# EasyEDA Pro project PicoPocket_Royal.epro

# Board PicoPocket_Royal
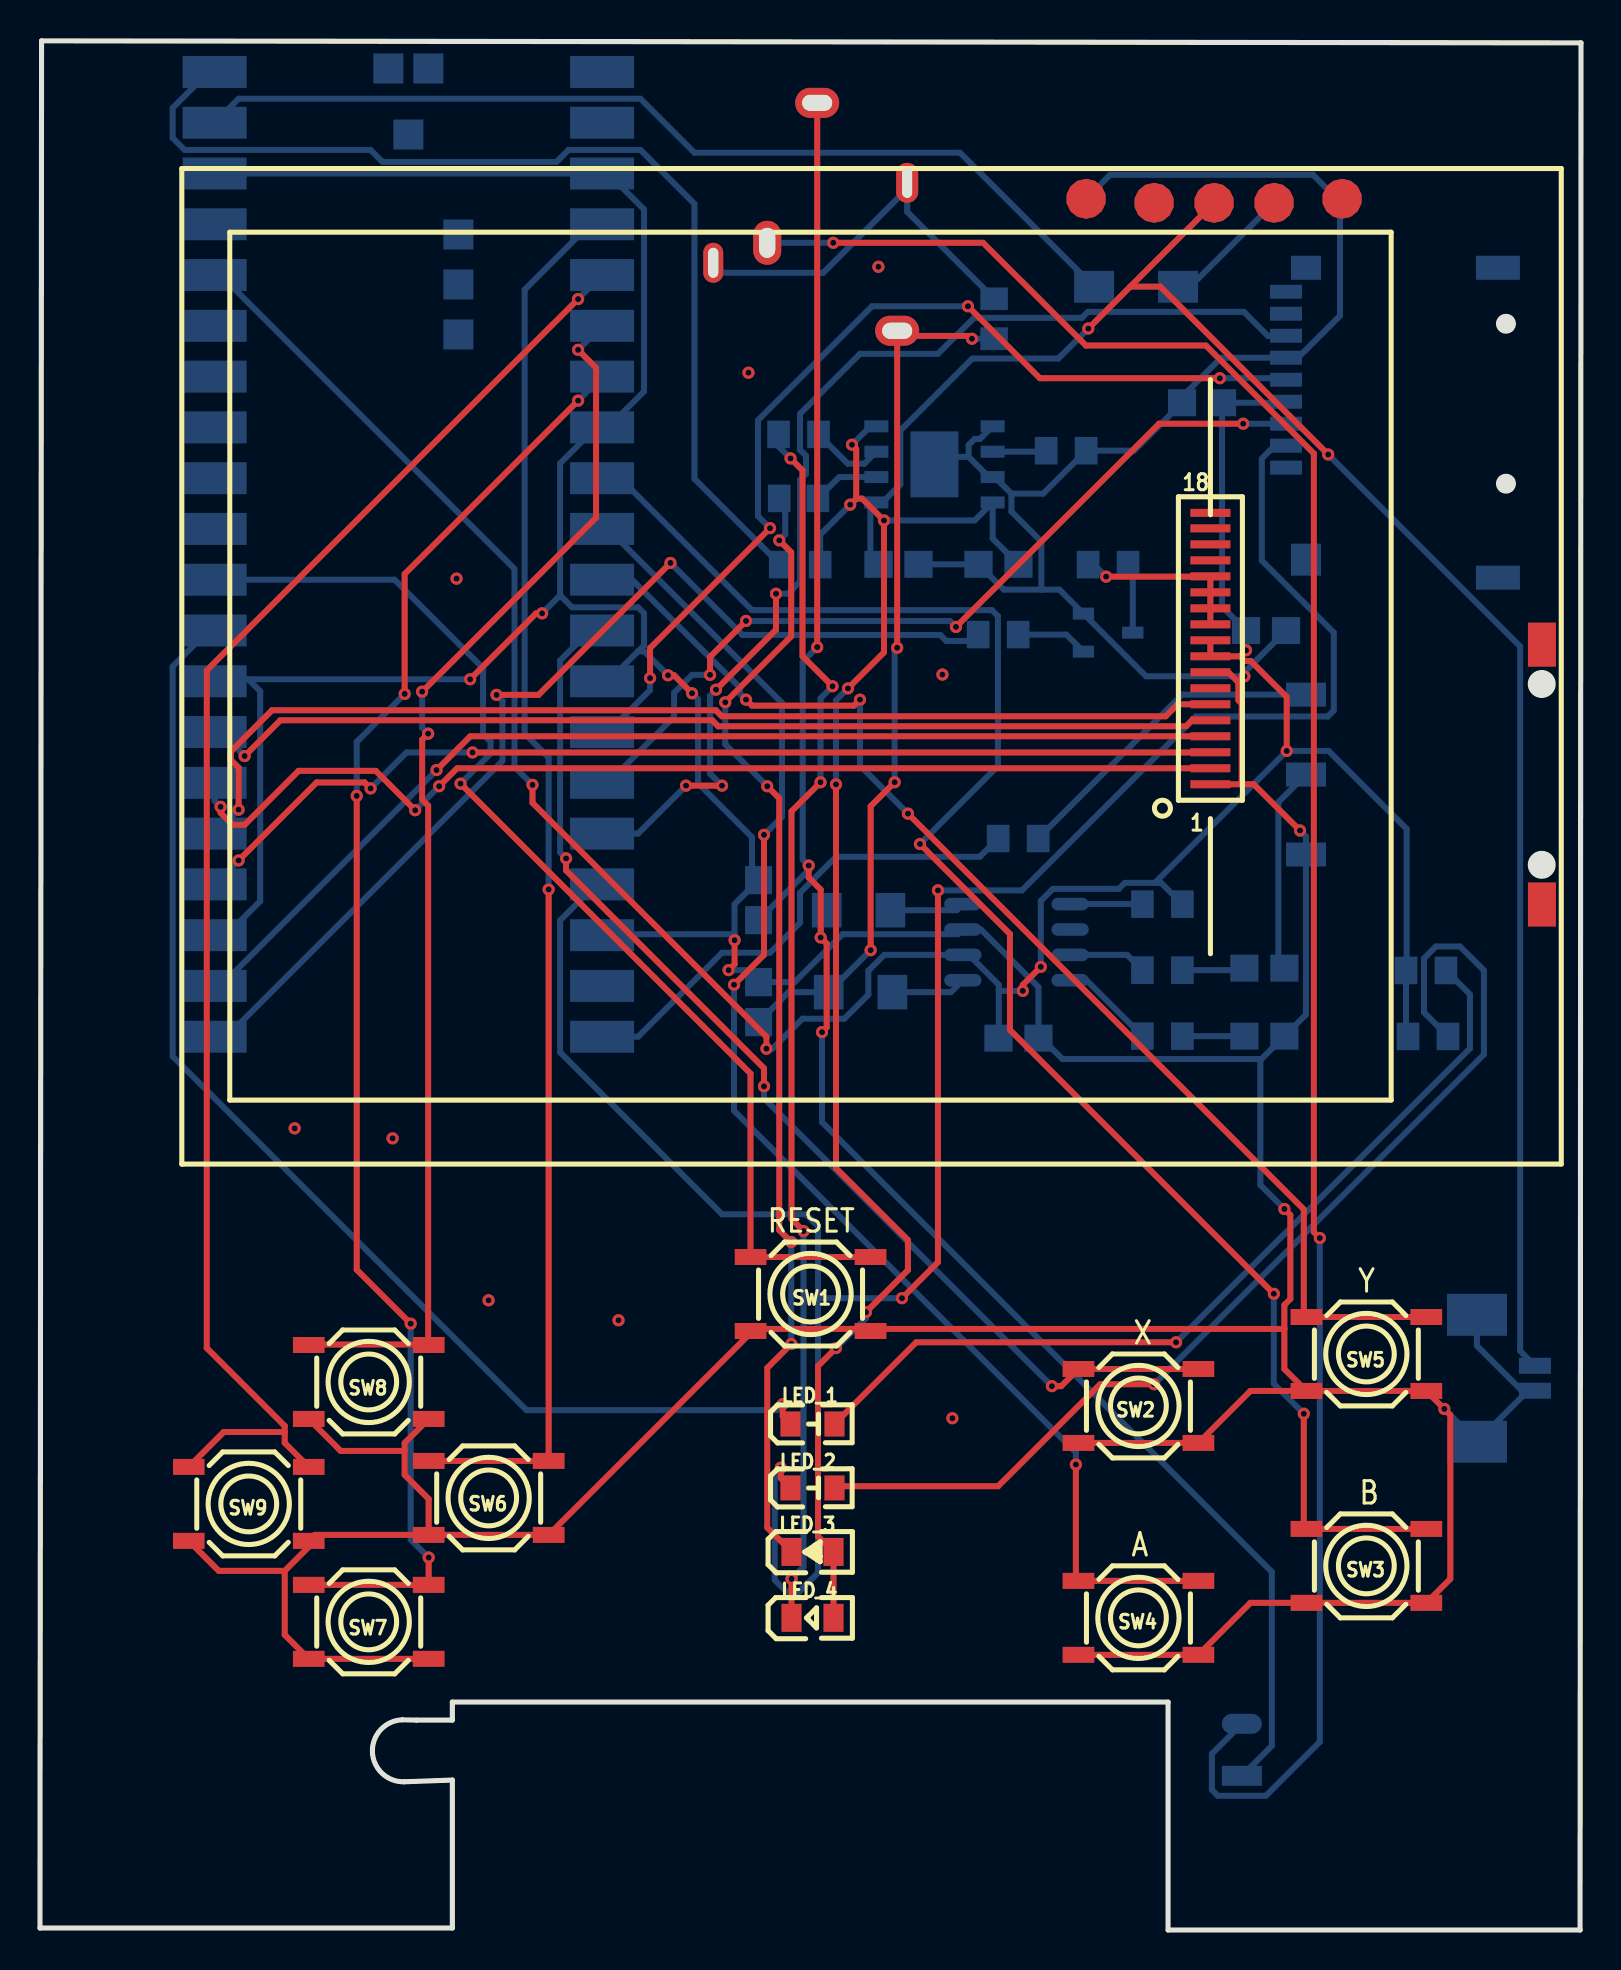
[diagram p0: board, top side]
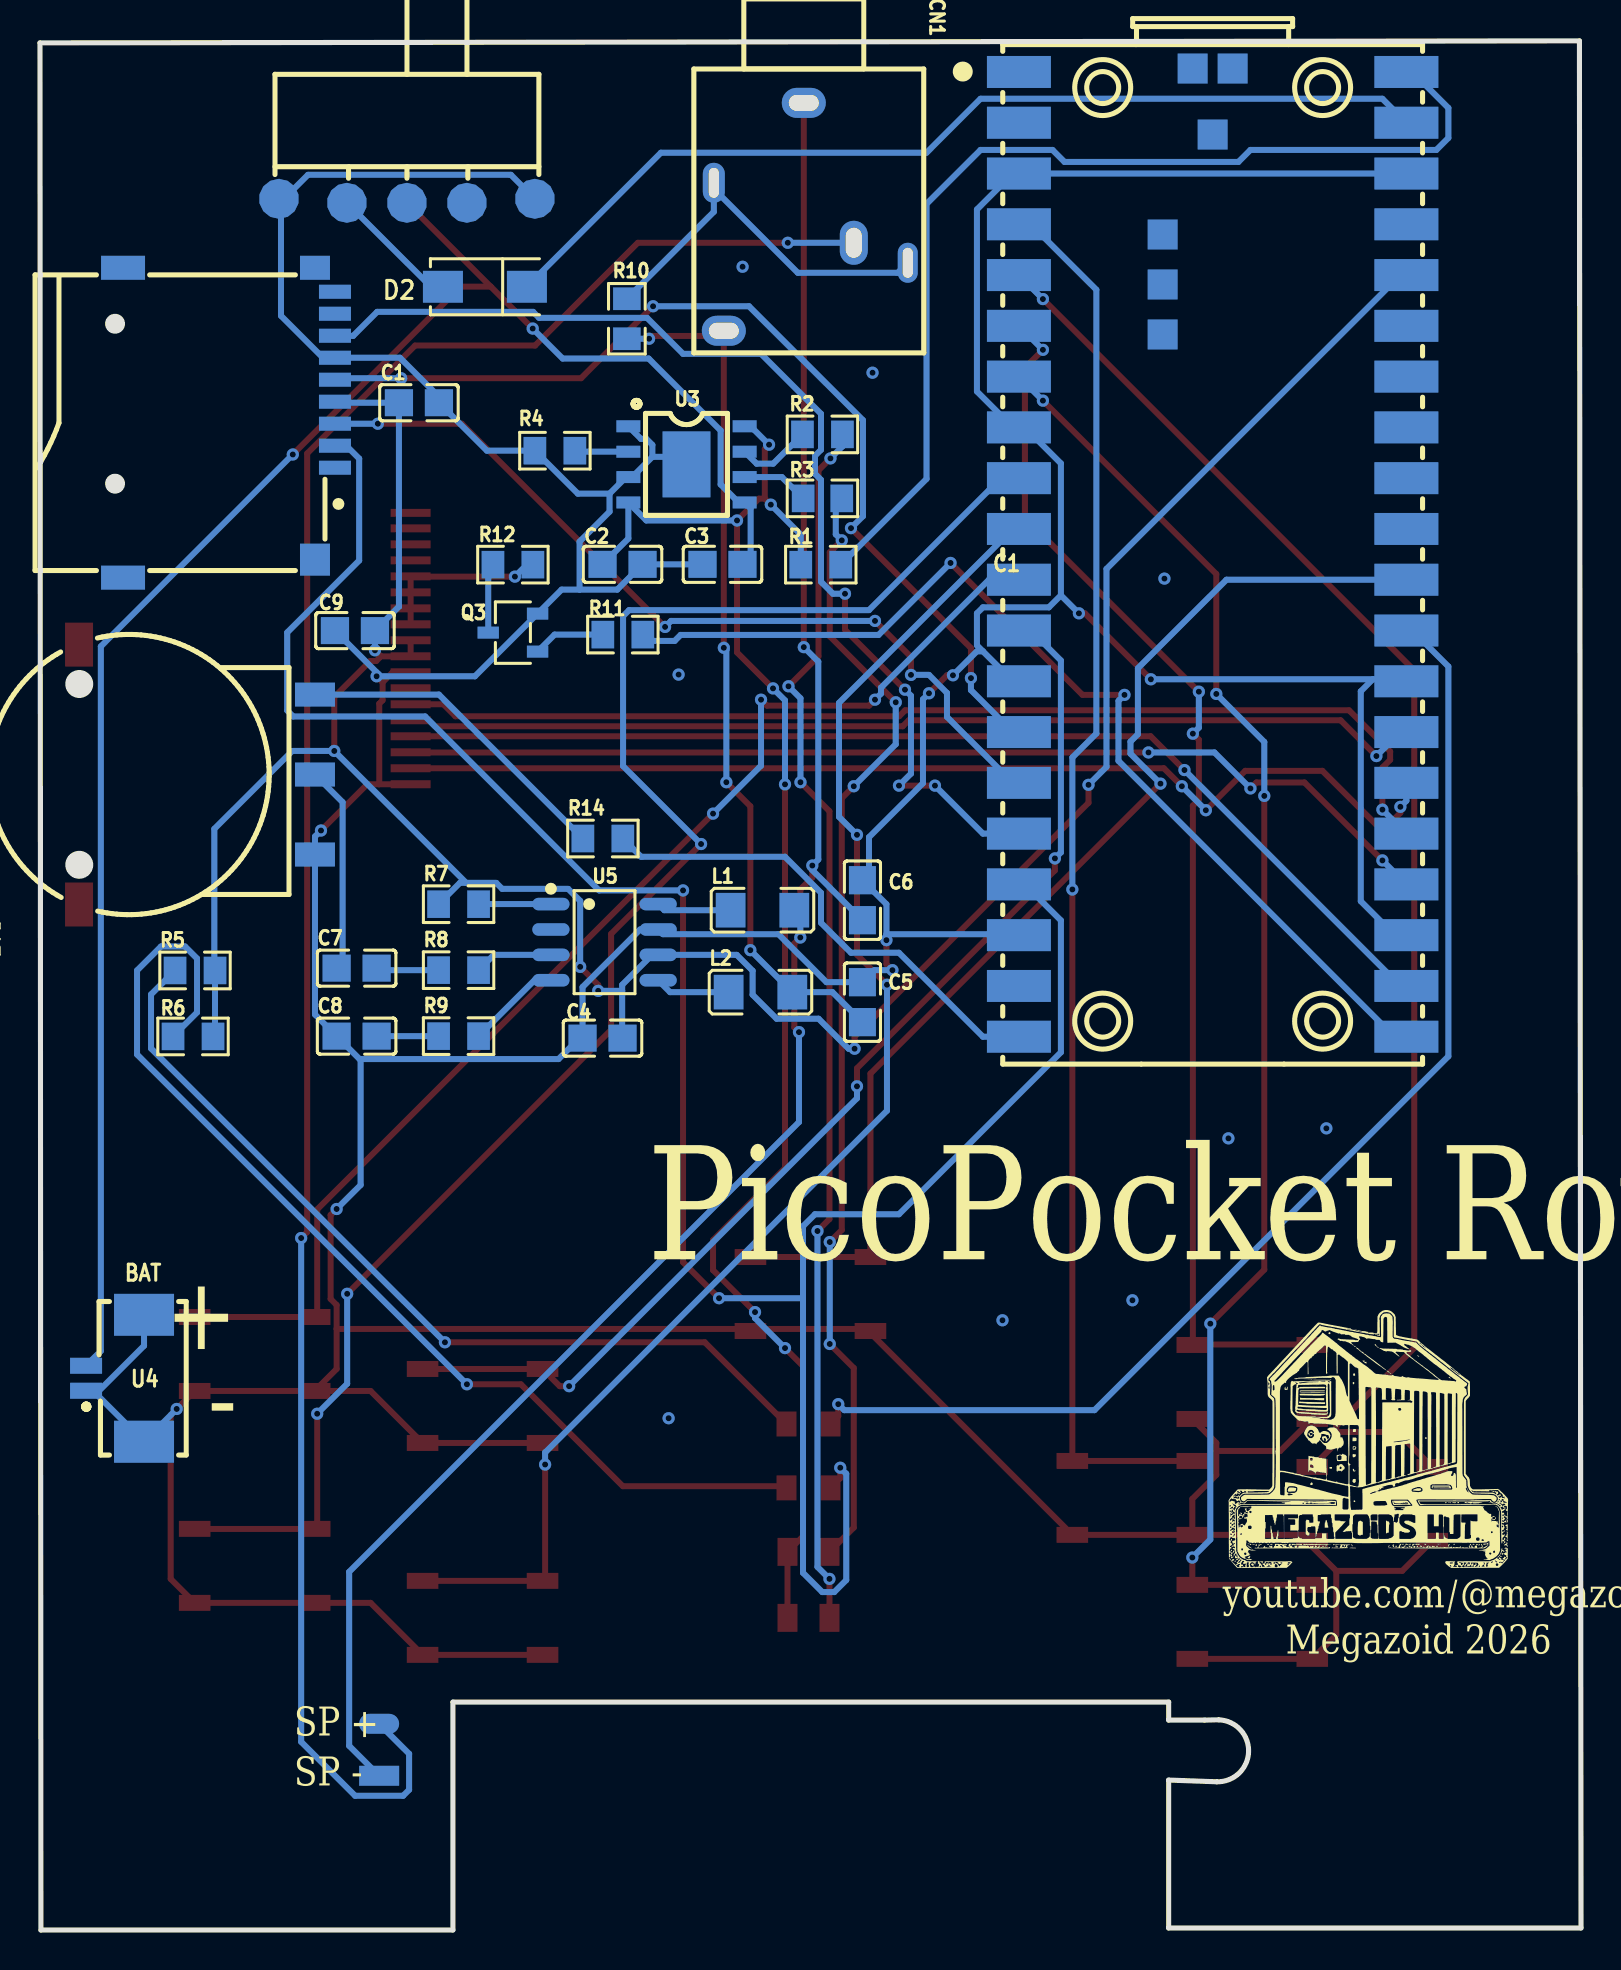
[diagram p1: board, bottom side, seen from below]

Outline 77.08 x 94.5 mm; copper layers: Top Layer, Bottom Layer. Coordinates in mm from the lower left corner of the outline.
Outline path: 0,0.1 0.08,94.5 77.08,94.4 77.03,0 56.43,0 56.43,11.4 20.62,11.4 20.62,10.5 18.83,10.5 18.12,10.52 arc(16.62,8.92) 18.22,7.41 20.62,7.5 20.62,0.1 0,0.1
Stack: Top Layer 0.035mm / Dielectric1 1.51mm FR4 er 4.5 / Bottom Layer 0.035mm

## Design rules (mm)
template: Custom Config
spacing copperThickness1oz (default): track to track 0.102, other pairs 0.152 to 0.3
spacing copperThickness2oz: track to track 0.203, other pairs 0.152 to 0.3
track width copperThickness1oz (default): min 0.127, default 0.3, max 2.54
track width copperThickness2oz: min 0.203, default 0.254, max 2.54
differential pair differentialPair (default): width min 0.127, default 0.254, max 2.54; gap min 0.152, default 0.152
via viaSize (default): diameter min 0.5, default 0.61, max 10; hole min 0.3, default 0.305, max 6.3

## Placement (name value [footprint] x y rotation side)
C1  100nF  [C0805]  58.12 76.4 0 bottom
C2  100nF  [C0805]  47.94 68.31 0 bottom
C3  100nF  [C0805]  42.94 68.31 180 bottom
C4  10uF  [C0805]  48.94 44.62 0 bottom
C5  220pF  [C0805]  35.94 46.42 270 bottom
C6  220pF  [C0805]  35.94 51.52 270 bottom
C7  1uF  [C0805]  61.24 48.12 180 bottom
C8  1uF  [C0805]  61.24 44.72 180 bottom
C9  100nF  [C0805]  61.33 65 180 bottom
CN1  PJ-324M  [AUDIO-TH_PJ-324M]  38.53 85.7 270 bottom
D2  SS12_C727049  [SMA_L4.3-W2.5-LS5.0-RD]  54.83 82.2 0 bottom
L1  -  [L1206]  40.94 51.02 180 bottom
L2  -  [L1206]  41.04 46.92 180 bottom
LCD2  LCD DISPLAY gmt028-01-p  [LCD DISPLAY ER-TFT020-2]  58.54 61.72 180 top
LED_1  LTST-C170KSKT  [LED0805-RD_YELLOW]  38.64 25.31 0 top
LED_2  LTST-C170KFKT  [LED0805-RD_ORANGE]  38.64 22.12 0 top
LED_3  LTST-C170TGKT  [LED0805-R-RD_GREEN]  38.64 18.91 0 top
LED_4  LTST-C170KRKT  [LED0805-R-RD]  38.64 15.62 0 top
NOREF  -  [Pad_ie745]  60.12 7.72 0 top
NOREF#2  -  [Pad_ie744]  60.12 10.31 180 top
Q3  S8050  [SOT-23-3_L2.9-W1.6-P1.90-LS2.8-BR]  53.43 64.9 180 bottom
R1  500mΩ  [R0805]  38.03 68.3 0 bottom
R2  33kΩ  [R0805]  37.94 74.81 180 bottom
R3  100kΩ  [R0805_NEW]  37.94 71.62 180 bottom
R4  5.1kΩ  [R0805]  51.33 74 180 bottom
R5  5.1kΩ  [R0805]  69.33 48 180 bottom
R6  5.1kΩ  [R0805]  69.43 44.7 180 bottom
R7  10kΩ  [R0805]  56.14 51.31 180 bottom
R8  100Ω  [R0805]  56.14 48.02 180 bottom
R9  100Ω  [R0805]  56.14 44.72 180 bottom
R10  470Ω  [R0805]  47.72 80.6 270 bottom
R11  1kΩ  [R0805]  47.93 64.8 0 bottom
R12  3.9Ω  [R0805]  53.43 68.3 180 bottom
R13  10kΩ  [RES-SMD_RK10J12R0A0B]  70.22 57.8 90 bottom
R14  1kΩ  [R0805]  48.93 54.6 180 bottom
SW1  -  [SW-SMD_4P-L5.2-W5.2-P3.70-LS6.4]  38.54 31.81 0 top
SW1#2  -  [SW-TH_KH-SS12F23-G6]  58.72 86.5 0 bottom
SW2  HX TS5220A 160GF  [SW-SMD_4P-L5.2-W5.2-P3.70-LS6.4]  54.94 26.22 0 top
SW3  HX TS5220A 160GF  [SW-SMD_4P-L5.2-W5.2-P3.70-LS6.4]  66.34 18.22 0 top
SW4  HX TS5220A 160GF  [SW-SMD_4P-L5.2-W5.2-P3.70-LS6.4]  54.94 15.62 0 top
SW5  HX TS5220A 160GF  [SW-SMD_4P-L5.2-W5.2-P3.70-LS6.4]  66.34 28.81 0 top
SW6  HX TS5220A 160GF  [SW-SMD_4P-L5.2-W5.2-P3.70-LS6.4]  22.44 21.62 0 top
SW7  HX TS5220A 160GF  [SW-SMD_4P-L5.2-W5.2-P3.70-LS6.4]  16.44 15.41 0 top
SW8  HX TS5220A 160GF  [SW-SMD_4P-L5.2-W5.2-P3.70-LS6.4]  16.44 27.42 0 top
SW9  HX TS5220A 160GF  [SW-SMD_4P-L5.2-W5.2-P3.70-LS6.4]  10.44 21.31 0 top
TF1  GT-TF003-H0185-01  [TF-SMD_GT-TF003-H0185-01]  67.62 75.4 270 bottom
U1  PICO W  [COMM-SMD_L51.0-W21.0-P2.54_PICOW]  18.43 68.9 270 bottom
U3  TP4056_C725790  [ESOP-8_L4.9-W3.9-P1.27-LS6.0-BL-EP]  44.74 73.31 270 bottom
U4  532610271  [CONN-SMD_532610271]  73.33 27.6 270 bottom
U5  PAM8302AADCR  [SOP-8_L4.9-W3.9-P1.27-LS6.0-BL]  48.84 49.42 270 bottom

## Footprints (pads in the part's own frame, mm; a bottom-side part is the same pattern mirrored in y, then rotated)
AUDIO-TH_PJ-324M
  oval 1.5x2.2 hole 0.8x1.5: 1(-5.7,-0.35) 4(5.7,-4.35)
  oval 2x1 hole 1.5x0.5: 2(2.3,4.85)
  oval 2.2x1.4 hole 1.5x0.8: 3(1.3,2.15)
  oval 2x1.1 hole 1.5x0.5: 5(-1.7,-4.85)
C0805
  rect 1.41x1.35 smd: 1(-1,0) 2(1,0)
COMM-SMD_L51.0-W21.0-P2.54_PICOW
  rect 1.6x3.2 smd: 1(-24.045,-9.69) 2(-21.505,-9.69) 3(-18.965,-9.69) 4(-16.425,-9.69) 5(-13.885,-9.69) 6(-11.345,-9.69) 7(-8.805,-9.69) 8(-6.265,-9.69) 9(-3.725,-9.69) 10(-1.185,-9.69) 11(1.355,-9.69) 12(3.895,-9.69) 13(6.435,-9.69) 14(8.975,-9.69) 15(11.515,-9.69) 16(14.055,-9.69) 17(16.595,-9.69) 18(19.135,-9.69) 19(21.675,-9.69) 20(24.215,-9.69) 21(24.215,9.69) 22(21.675,9.69) 23(19.135,9.69) 24(16.595,9.69) 25(14.055,9.69) 26(11.515,9.69) 27(8.975,9.69) 28(6.435,9.69) 29(3.895,9.69) 30(1.355,9.69) 31(-1.185,9.69) 32(-3.725,9.69) 33(-6.265,9.69) 34(-8.805,9.69) 35(-11.345,9.69) 36(-13.885,9.69) 37(-16.425,9.69) 38(-18.965,9.69) 39(-21.505,9.69) 40(-24.045,9.69)
  rect 1.5x1.5 smd: TP1(-20.915,0) TP2(-24.215,1) TP3(-24.215,-1) TP4(-15.915,-2.5) TP5(-13.415,-2.5) TP6(-10.915,-2.5)
CONN-SMD_532610271
  rect 0.8x1.6 smd: 1(0.625,-1.45) 2(-0.625,-1.45)
  rect 2.1x3 smd: 3(3.175,1.45) 4(-3.175,1.45)
ESOP-8_L4.9-W3.9-P1.27-LS6.0-BL-EP
  rect 0.6x1.2 smd: 1(-1.905,-2.908) 2(-0.635,-2.908) 3(0.635,-2.908) 4(1.905,-2.908) 5(1.905,2.909) 6(0.635,2.909) 7(-0.635,2.909) 8(-1.905,2.909)
  rect 3.3x2.4 smd: 9(0,0)
L1206
  rect 1.485x1.728 smd: 1(-1.593,0) 2(1.593,0)
LCD DISPLAY ER-TFT020-2
  rect 2x0.4 smd: 1(0,4.4) 2(0,3.6) 3(0,2.8) 4(0,2) 5(0,1.2) 6(0,0.4) 7(0,-0.4) 8(0,-1.2) 9(0,-2) 10(0,-2.8) 11(0.001,-3.599) 12(0.001,-4.399) 13(0.001,-5.2) 14(0.001,-6) 15(0.001,-6.8) 16(0.001,-7.599) 17(0.001,-8.399) 18(0.001,-9.175)
LED0805-R-RD
  rect 1x1.399 smd: 1(1.05,0) 2(-1.05,0)
LED0805-R-RD_GREEN
  rect 1x1.399 smd: 1(1.05,0) 2(-1.05,0)
LED0805-RD_ORANGE
  rect 1x1.25 smd: 1(-1.1,0) 2(1.1,0)
LED0805-RD_YELLOW
  rect 1x1.25 smd: 1(-1.1,0) 2(1.1,0)
Pad_ie744
  oval 2x1 smd far side: 1(0,0)
Pad_ie745
  rect 2x1 smd far side: 1(0,0)
R0805
  rect 1.133x1.377 smd: 1(-1,0) 2(1,0)
R0805_NEW
  rect 1.133x1.377 smd: 1(-0.966,0) 2(0.966,0)
RES-SMD_RK10J12R0A0B
  rect 1.2x2 smd: 1(-4,-6.9) 3(4,-6.9) 4(0,-6.9)
  rect 2.2x1.4 smd far side: 6(-6.5,4.9) 6(6.5,4.9)
SMA_L4.3-W2.5-LS5.0-RD
  rect 2x1.593 smd: 1(-2.1,0) 2(2.1,0)
SOP-8_L4.9-W3.9-P1.27-LS6.0-BL
  oval 0.63x1.865 smd: 1(-1.905,-2.683) 2(-0.635,-2.683) 3(0.635,-2.683) 4(1.905,-2.683) 5(1.905,2.683) 6(0.635,2.683) 7(-0.635,2.683) 8(-1.905,2.683)
SOT-23-3_L2.9-W1.6-P1.90-LS2.8-BR
  rect 1.07x0.6 smd: 1(1.235,-0.95) 2(1.235,0.95) 3(-1.235,0)
SW-SMD_4P-L5.2-W5.2-P3.70-LS6.4
  rect 1.58x0.8 smd: 1(-3,1.85) 2(3,1.85) 3(-3,-1.85) 4(3,-1.85)
SW-TH_KH-SS12F23-G6
  custom 1.95x2 hole 1.205x1.2: 1(-2.999,0.1) 2(0.001,0.1) 3(3.001,0.1) 4(6.401,-0.1) 5(-6.4,-0.1)
TF-SMD_GT-TF003-H0185-01
  rect 0.7x1.6 smd: 1(2.25,5.3) 2(1.15,5.3) 3(0.05,5.3) 4(-1.05,5.3) 5(-2.15,5.3) 6(-3.25,5.3) 7(-4.35,5.3) 8(-5.45,5.3) CD(-6.55,5.3)
  rect 1.2x1.5 smd: 9(-7.75,4.3)
  rect 1.2x2.2 smd: 10(-7.75,-5.3) 11(7.75,-5.3)
  rect 1.6x1.5 smd: 12(6.85,4.3)

## Nets
+3V3: C1.2 C4.1 C9.2 LCD2.9 LCD2.10 R5.2 R6.2 R7.1 TF1.4 U1.36 U5.6
GND: C1.1 C2.1 C3.1 C4.2 C5.1 C6.1 C8.1 C9.1 LCD2.1 LCD2.8 Q3.2 R4.1 R13.1 SW1.3 SW1.4 SW1#2.4 SW1#2.5 SW2.3 SW2.4 SW3.3 SW3.4 SW4.3 SW4.4 SW5.3 SW5.4 SW6.3 SW6.4 SW7.3 SW7.4 SW8.3 SW8.4 SW9.3 SW9.4 TF1.6 U1.3 U1.8 U1.13 U1.18 U1.23 U1.28 U1.38 U3.1 U3.3 U3.9 U4.1 U4.3 U4.4 U5.7
VBUS: R1.1 U1.40
A: SW4.1 SW4.2 U1.10
B: SW3.1 SW3.2 U1.9
BAT: D2.1 U1.39
DOWN: SW7.1 SW7.2 U1.7
LCD_BL: R11.1 U1.21
LCD_CS: LCD2.5 U1.27
LCD_DC: LCD2.4 U1.22
LCD_MOSI: LCD2.6 U1.25
LCD_RES: LCD2.2 U1.26
LCS_SCK: LCD2.3 U1.24
LED1: LED_1.1 U1.29
LEFT: SW9.1 SW9.2 U1.5
PED1: C7.1 R13.4
RESET: SW1.1 SW1.2 U1.30
RIGHT: SW6.1 SW6.2 U1.4
SD_SPI1_CS: LED_2.1 TF1.2 U1.17
SD_SPI1_MISO: TF1.7 U1.16
SD_SPI1_MOSI: TF1.3 U1.15
SD_SPI1_SCK: TF1.5 U1.14
SOUND: R14.2 U1.20
UP: SW8.1 SW8.2 U1.6
VO+: C5.2 CN1.4 L2.2 R10.2
VO-: C6.2 CN1.1 L1.2 NOREF.1
X: SW2.1 SW2.2 U1.12
Y: SW5.1 SW5.2 U1.11
$1N2997: C2.2 LED_3.1 LED_4.1 R1.2 U3.4 U3.8
$1N2999: LED_4.2 R2.2
$1N3000: LED_3.2 R3.2
$1N3001: C3.2 SW1#2.2 U3.5 U4.2
$1N3005: D2.2 SW1#2.3
$1N3006: LED_1.2 R5.1
$1N3007: LED_2.2 R6.1
$1N3033: R7.2 U5.1
$1N3034: L2.1 U5.5
$1N3036: L1.1 U5.8
$1N3039: R8.2 U5.3
$1N3040: R9.2 U5.4
$1N3042: C8.2 R9.1
$1N3043: C7.2 R8.1
$1N3051: R13.3 R14.1
$1N3052: CN1.3 NOREF#2.1
$1N3053: CN1.2 CN1.5 R10.1
$1N3056: LCD2.11 LCD2.12 LCD2.13 LCD2.14 R12.2
$1N3058: Q3.1 R11.2
$1N3060: Q3.3 R12.1
$1N3070: R2.1 U3.7
$1N3071: R3.1 U3.6
$1N3073: R4.2 U3.2

Pads without a net: LCD2 7 15 16 17 18; R13 6; SW1#2 1; TF1 1 8 9 10 11 12 CD; U1 1 2 19 31 32 33 34 35 37 TP1 TP2 TP3 TP4 TP5 TP6; U5 2

## Via types
v1: diameter 0.61, hole 0.305, Top Layer to Bottom Layer, 107 vias

## Routing (per net, layer and track width the routed paths; a pad name or vN(x,y) marks a point on that pad's centre or on a via; arc(x,y) is an arc through that point)
+3V3: length 133.9
  Top Layer w0.3: LCD2.10 LCD2.9 60.02,63.72 ; v1(36.34,44.09) 36.34,44.69 24.64,56.39 v1(24.64,57.29) ; v1(50.06,48.18) 49.16,47.28 v1(49.16,46.98) ; v1(62.36,58.98) 62.36,61.68 60.56,63.48 60.26,63.48 60.02,63.72 ; 60.02,63.72 v1(60.32,64.02)
  Bottom Layer w0.3: C4.1 47.96,44.63 47.96,46.98 ; v1(36.34,44.09) 36.64,44.09 38.13,45.59 40.23,45.59 41.43,46.79 41.43,47.98 42.23,48.78 U5.6 46.46,48.78 47.96,47.28 47.96,46.98 ; v1(50.06,48.18) 50.06,51.48 50.66,52.08 53.96,52.08 54.26,52.38 55.76,52.38 ; v1(60.32,64.02) C9.2 59.12,66.2 C1.2 62.28,76.4 TF1.4 ; 47.96,46.98 v1(49.16,46.98) ; v1(24.64,57.29) 23.74,58.19 23.74,68.09 9.04,82.79 U1.36 ; 55.76,52.38 v1(62.36,58.98) 64.46,58.98 68.36,55.08 68.36,48.03 R5.2 68.33,44.8 R6.2 ; 55.76,52.38 56.08,52.38 R7.1
GND: length 405.2
  Top Layer w0.3: 18.24,23.97 18.24,22.77 19.44,21.56 SW6.3 ; 18.24,23.97 15.04,23.97 SW8.3 ; 18.24,23.97 18.24,24.37 SW8.4 ; 62.24,30.07 62.24,28.06 SW5.3 ; 62.24,30.07 62.24,31.27 62.54,31.57 62.54,35.77 v1(62.24,36.07) ; 62.24,30.07 41.64,30.07 ; SW6.3 13.74,19.77 SW9.4 13.44,19.16 12.24,17.97 ; SW6.3 SW6.4 35.74,30.07 ; v1(31.41,62.77) 31.71,62.77 v1(32.61,61.87) ; 41.64,30.07 35.74,30.07 ; 41.64,30.07 SW1.4 ; 35.74,30.07 35.64,30.07 SW1.3 ; SW4.3 SW4.4 60.54,16.37 SW3.3 SW3.4 70.54,17.56 70.54,25.77 v1(70.24,26.06) SW5.4 SW5.3 ; v1(34.74,49.52) 34.74,48.31 v1(34.44,48.02) ; SW2.3 SW2.4 60.54,26.97 SW5.3 ; 60.11,57.31 60.71,57.31 v1(63.03,55) ; 60.11,57.31 LCD2.1 ; 60.11,57.31 60.11,61.35 59.94,61.52 59.94,62.42 ; SW7.4 SW7.3 12.24,14.77 12.24,17.97 ; LCD2.8 59.44,62.92 59.94,62.42 ; 59.94,62.42 v1(60.24,62.72) ; SW9.3 8.94,17.97 12.24,17.97 ; v1(25.12,65.87) 24.81,65.87 v1(21.52,62.56)
  Bottom Layer w0.3: 61.04,43.57 61.09,43.57 C8.1 63.33,45.8 R13.1 63.33,54.7 v1(63.03,55) ; 61.04,43.57 51.14,43.57 49.94,44.77 ; 61.04,43.57 61.04,37.27 v1(62.24,36.07) ; 29.91,63.97 28.41,62.47 U1.13 ; 29.91,63.97 30.22,63.97 v1(31.41,62.77) ; 29.91,63.97 30.22,64.27 30.22,65.87 29.91,66.17 26.62,66.17 26.02,66.77 ; 10.42,62.56 11.02,61.97 11.02,51.47 9.31,49.77 U1.23 ; 10.42,62.56 8.84,62.56 U1.28 ; 10.42,62.56 v1(21.52,62.56) ; C9.1 60.24,62.92 v1(60.24,62.72) 55.33,62.72 Q3.2 50.99,67.05 50.09,67.05 ; 48.59,71.85 50.18,71.85 R4.1 54.72,74 C1.1 57.12,76.7 59.07,78.65 TF1.6 62.93,78.65 65.03,80.75 65.03,86.45 ; 48.59,71.85 47.76,72.68 47.46,72.68 46.45,73.69 ; 48.59,71.85 48.59,70.95 50.09,69.45 50.09,67.05 ; v1(32.61,61.87) 32.91,61.56 32.91,57.37 35.61,54.67 35.61,52.84 C6.1 34.74,51.31 34.74,49.81 ; 26.02,66.77 26.02,73.37 27.81,75.17 U1.8 28.41,75.17 30.22,76.97 30.22,86.06 28.41,87.87 U1.3 U1.38 ; 26.02,66.77 v1(25.12,65.87) ; 65.03,86.45 SW1#2.4 ; 65.03,86.45 63.68,87.8 53.53,87.8 SW1#2.5 ; 50.09,67.05 48.21,67.05 C2.1 C3.1 ; v1(34.44,48.02) 35.34,48.02 C5.1 37.74,47.42 40.14,49.81 45.92,49.81 U5.7 47.06,50.05 49.94,47.17 49.94,44.77 ; U3.9 45.12,73.69 46.45,73.69 ; 49.94,44.77 C4.2 ; 70.24,26.06 U4.3 74.28,26.83 ; U4.1 74.62,26.83 74.28,26.83 ; 74.28,26.83 71.88,29.23 U4.4 ; 46.45,73.69 46.45,74.29 46.75,74.59 47.02,74.59 U3.1 ; 34.74,49.81 v1(34.74,49.52) ; 34.74,49.81 28.16,49.81 U1.18
  vias: v1(12.74,40.1) v1(17.64,39.6) v1(20.84,67.6) v1(22.44,31.5) v1(28.94,30.5) v1(35.44,77.9) v1(41.94,83.2) v1(45.14,62.8) v1(45.64,25.6)
VBUS: length 52.1
  Bottom Layer w0.3: U1.40 8.44,92.95 6.64,91.15 6.64,89.65 7.23,89.05 16.53,89.05 17.14,88.45 25.84,88.45 26.44,89.05 30.03,89.05 32.74,86.34 32.74,72.59 R1.1
A: length 70.7
  Top Layer w0.3: v1(36.21,54.79) 36.21,48.79 v1(34.71,47.29) ; v1(51.81,23.29) 51.81,17.59 SW4.1 SW4.2
  Bottom Layer w0.3: U1.10 28.41,70.09 37.11,61.39 37.11,55.69 v1(36.21,54.79) ; v1(34.71,47.29) 34.71,40.98 51.81,23.89 v1(51.81,23.29)
B: length 83.9
  Top Layer w0.3: v1(61.71,31.83) 48.51,45.03 48.51,49.83 v1(44.01,54.33) ; SW3.2 SW3.1 63.21,20.19 v1(63.21,25.83)
  Bottom Layer w0.3: U1.9 29.02,72.62 35.61,66.03 47.61,66.03 47.91,65.73 47.91,58.23 v1(44.01,54.33) ; v1(61.71,31.83) 61.71,27.33 v1(63.21,25.83)
BAT: length 48.4
  Bottom Layer w0.3: D2.1 46.02,88.91 32.74,88.91 30.03,91.61 9.94,91.61 U1.39
DOWN: length 73
  Top Layer w0.3: v1(26.91,76.51) 18.24,67.83 v1(18.24,61.83) ; SW7.1 SW7.2 v1(19.44,18.63) ; v1(18.54,30.33) 15.84,33.03 v1(15.84,56.73)
  Bottom Layer w0.3: v1(19.44,18.63) 18.54,19.53 v1(18.54,30.33) ; v1(18.24,61.83) 15.84,59.43 v1(15.84,56.73) ; U1.7 v1(26.91,76.51)
LCD_BL: length 52.1
  Top Layer w0.3: v1(22.84,61.79) 24.94,61.79 v1(31.53,68.39)
  Bottom Layer w0.3: v1(22.84,61.79) 23.14,61.48 23.14,58.48 9.34,44.69 U1.21 ; v1(31.53,68.39) 35.14,64.79 45.03,64.79 45.33,64.48 46.61,64.48 R11.1
LCD_CS: length 51.3
  Top Layer w0.3: v1(10.23,58.73) 12.02,60.52 33.62,60.52 33.92,60.22 57.32,60.22 57.62,60.52 LCD2.5
  Bottom Layer w0.3: U1.27 9.04,59.93 v1(10.23,58.73)
LCD_DC: length 55
  Top Layer w0.3: v1(19.84,58.03) 21.53,59.72 LCD2.4
  Bottom Layer w0.3: v1(19.84,58.03) 9.04,47.23 U1.22
LCD_MOSI: length 55
  Top Layer w0.3: LCD2.6 56.9,61.31 56.3,60.72 34.1,60.72 33.8,61.02 11.6,61.02 9.55,58.96 9.55,58.53 9.94,58.15 v1(9.94,56.05)
  Bottom Layer w0.3: U1.25 v1(9.94,56.05)
LCD_RES: length 54.2
  Top Layer w0.3: v1(9.04,56.19) 9.04,55.89 9.64,55.29 10.23,55.29 12.94,57.98 16.8,57.98 v1(18.77,56.02) ; LCD2.2 20.87,58.12 v1(19.97,57.22)
  Bottom Layer w0.3: U1.26 8.73,56.48 v1(9.04,56.19) ; v1(18.77,56.02) v1(19.97,57.22)
LCS_SCK: length 52.8
  Top Layer w0.3: v1(9.94,53.51) 13.84,57.41 16.24,57.41 v1(16.53,57.11) ; v1(21.64,58.91) 58.53,58.91 LCD2.3
  Bottom Layer w0.3: v1(21.64,58.91) 18.34,58.91 v1(16.53,57.11) ; U1.24 v1(9.94,53.51)
LED1: length 61.5
  Top Layer w0.3: LED_1.1 37.15,25.7 v1(37.15,26.31)
  Bottom Layer w0.3: U1.29 8.44,65.01 6.64,63.2 6.64,43.7 24.34,26.01 36.85,26.01 v1(37.15,26.31)
LEFT: length 75.4
  Top Layer w0.3: 12.24,24.91 12.24,24.37 SW9.2 ; 12.24,24.91 12.24,25.21 8.34,29.11 8.34,63.01 v1(26.91,81.59) ; 12.24,24.91 9.19,24.91 SW9.1
  Bottom Layer w0.3: U1.5 v1(26.91,81.59)
PED1: length 10.4
  Bottom Layer w0.3: R13.4 61.94,56.42 61.94,48.42 C7.1
RESET: length 57.5
  Top Layer w0.3: v1(21.03,57.34) 35.54,42.84 SW1.1 SW1.2
  Bottom Layer w0.3: v1(21.03,57.34) 22.53,58.84 22.53,59.45 22.16,59.82 22.16,63.12 17.74,67.55 U1.30
RIGHT: length 70.3
  Top Layer w0.3: SW6.1 SW6.2 v1(25.44,52.05)
  Bottom Layer w0.3: U1.4 27.52,85.33 24.24,82.05 24.24,59.85 25.44,58.65 v1(25.44,52.05)
SD_SPI1_CS: length 117.5
  Top Layer w0.3: LED_2.1 37.05,22.61 v1(37.05,23.12) ; v1(44.91,52.01) 44.91,33.41 v1(43.11,31.61)
  Bottom Layer w0.3: 38.91,31.61 v1(43.11,31.61) ; 38.91,31.61 38.91,17.87 37.95,16.91 37.35,16.91 36.75,17.5 36.75,22.83 v1(37.05,23.12) ; 38.91,31.61 38.91,35.2 38.31,35.81 34.11,35.81 26.02,43.91 26.02,50.51 27.81,52.31 U1.17 ; TF1.2 62.28,74.2 61.71,74.2 61.11,73.61 61.11,68.51 64.71,64.91 64.71,61.01 64.41,60.7 57.81,60.7 49.11,52.01 v1(44.91,52.01)
SD_SPI1_MISO: length 55.2
  Top Layer w0.3: v1(36.81,66.84) 36.81,65.05 v1(33.81,62.05) ; v1(32.31,57.25) v1(34.11,57.25)
  Bottom Layer w0.3: U1.16 29.91,54.84 v1(32.31,57.25) ; v1(36.81,66.84) 37.41,66.84 38.01,67.45 38.01,72.55 38.31,72.84 38.31,73.75 38.01,74.05 38.01,75.84 41.01,78.84 44.91,78.84 46.71,80.65 52.11,80.65 52.41,80.95 60.21,80.95 61.41,79.75 62.32,79.75 ; v1(34.11,57.25) 33.51,57.84 33.51,61.75 v1(33.81,62.05)
SD_SPI1_MOSI: length 43.1
  Top Layer w0.3: v1(33.51,62.79) 33.51,63.69 v1(35.31,65.48) ; v1(60.18,75.35) 55.98,75.35 v1(45.81,65.19)
  Bottom Layer w0.3: v1(35.31,65.48) 45.51,65.48 v1(45.81,65.19) ; v1(60.18,75.35) TF1.3 ; U1.15 28.41,57.39 31.71,60.69 31.71,61.89 32.61,62.79 v1(33.51,62.79)
SD_SPI1_SCK: length 49.8
  Top Layer w0.3: v1(46.41,81.23) 50.01,77.62 v1(59.01,77.62) ; v1(30.51,62.62) 30.51,64.12 v1(36.51,70.12)
  Bottom Layer w0.3: U1.14 28.41,59.93 30.51,62.03 v1(30.51,62.62) ; v1(59.01,77.62) 62.25,77.62 TF1.5 ; v1(46.41,81.23) 41.61,81.23 35.91,75.53 35.91,70.73 v1(36.51,70.12)
SOUND: length 24.8
  Bottom Layer w0.3: U1.20 29.91,44.69 34.11,48.89 36.51,48.89 38.01,50.39 38.01,51.89 39.81,53.69 47.01,53.69 R14.2
UP: length 61.8
  Top Layer w0.3: v1(19.41,59.84) 19.12,59.55 19.12,56.55 19.41,56.25 19.41,29.29 ; 19.41,29.29 13.47,29.29 SW8.1 ; 19.41,29.29 SW8.2 ; v1(26.91,79.05) 27.81,78.15 27.81,70.65 v1(19.12,61.95)
  Bottom Layer w0.3: v1(19.12,61.95) 19.12,60.15 v1(19.41,59.84) ; U1.6 v1(26.91,79.05)
VO+: length 43.5
  Top Layer w0.3: 42.88,79.74 CN1.4 ; 42.88,79.74 46.47,79.74 v1(46.62,79.6) ; 42.88,79.74 v1(42.88,64.14) ; v1(42.75,57.42) 41.55,56.22 v1(41.55,49.02)
  Bottom Layer w0.3: v1(42.75,57.42) 42.75,64.02 v1(42.88,64.14) ; C5.2 37.44,46.92 L2.2 v1(41.55,49.02) ; v1(46.62,79.6) R10.2
VO-: length 99.8
  Top Layer w0.3: v1(38.88,64.17) CN1.1 ; v1(38.45,53.25) 38.45,52.65 39.05,52.05 v1(39.05,49.65) 39.35,49.35 39.35,45.15 v1(39.12,44.92)
  Bottom Layer w0.3: C6.2 38.45,53.02 v1(38.45,53.25) 38.15,53.55 38.15,63.45 v1(38.88,64.17) ; L1.2 39.05,50.72 v1(39.05,49.65) ; v1(39.12,44.92) 39.12,40.42 61.62,17.91 61.62,9.22 NOREF.1
X: length 56.9
  Top Layer w0.3: v1(26.31,53.61) 26.31,53.01 36.21,43.11 v1(36.21,42.2) ; v1(50.61,27.2) 51.08,27.2 SW2.1 SW2.2
  Bottom Layer w0.3: v1(36.21,42.2) 36.21,41.61 v1(50.61,27.2) ; U1.12 27.52,65.01 26.02,63.51 26.02,53.91 v1(26.31,53.61)
Y: length 61.9
  Top Layer w0.3: v1(41.01,61.55) 40.71,61.25 35.61,61.25 v1(35.31,61.55) ; SW5.2 SW5.1 63.21,30.79 63.21,36.05 v1(43.41,55.84)
  Bottom Layer w0.3: v1(35.31,61.55) 35.01,61.84 35.01,62.15 29.62,67.55 U1.11 ; v1(43.41,55.84) 41.01,58.25 v1(41.01,61.55)
$1N2997: length 79.3
  Top Layer w0.3: v1(40.41,62.11) 42.22,63.91 v1(42.22,70.51) 41.12,71.6 40.83,71.6 ; v1(40.53,71.3) 40.83,71.6 ; 40.83,71.6 40.83,74.09 v1(40.61,74.3) ; v1(39.81,29.11) 38.91,28.21 38.91,19.69 LED_3.1 LED_4.1 ; v1(41.31,30.91) 43.41,33.01 43.41,34.51 39.81,38.11 v1(39.81,57.31)
  Bottom Layer w0.3: R1.2 39.03,69.8 v1(40.53,71.3) ; v1(40.41,62.11) 39.81,61.51 v1(39.81,57.31) ; U3.8 41.53,75.22 v1(40.61,74.3) ; C2.2 47.65,69.61 U3.4 46.75,70.51 v1(42.22,70.51) ; v1(39.81,29.11) 41.31,30.61 v1(41.31,30.91)
$1N2999: length 61.7
  Top Layer w0.3: v1(37.54,73.62) 38.14,73.02 38.14,63.72 v1(39.64,62.22) ; v1(37.59,17.56) LED_4.2 ; v1(39.04,57.42) 37.59,55.96 37.59,35.56 v1(38.19,34.97)
  Bottom Layer w0.3: v1(37.59,17.56) 38.19,18.16 v1(38.19,34.97) ; v1(37.54,73.62) 36.94,74.22 R2.2 ; v1(39.04,57.42) 39.04,61.62 v1(39.64,62.22)
$1N3000: length 56.9
  Top Layer w0.3: v1(36.98,69.52) 37.58,68.92 37.58,64.72 v1(34.28,61.42) ; LED_3.2 36.38,20.13 36.38,28.12 v1(37.58,29.31) ; v1(37.58,34.42) 36.98,35.02 36.98,56.62 v1(36.38,57.22)
  Bottom Layer w0.3: 36.98,71.62 37.28,71.31 37.28,69.81 v1(36.98,69.52) ; v1(34.28,61.42) 34.28,59.31 v1(36.38,57.22) ; v1(37.58,34.42) v1(37.58,29.31)
$1N3001: length 91.3
  Top Layer w0.3: v1(52.44,80.11) 54.53,82.21 ; 54.53,82.21 56.03,82.21 v1(64.44,73.81) ; 54.53,82.21 SW1#2.2
  Bottom Layer w0.3: v1(52.44,80.11) 50.94,78.61 46.63,78.61 43.03,75.01 43.03,72.31 42.13,71.41 U3.5 41.53,71.11 41.53,68.72 C3.2 ; U4.2 74.03,28.97 74.03,64.21 v1(64.44,73.81)
$1N3005: length 6.5
  Bottom Layer w0.3: SW1#2.3 57.53,82.2 D2.2
$1N3006: length 44
  Top Layer w0.3: LED_1.2 43.83,29.4 v1(56.83,29.4)
  Bottom Layer w0.3: v1(56.83,29.4) 71.53,44.1 71.53,46.8 R5.1
$1N3007: length 53.8
  Top Layer w0.3: LED_2.2 39.83,22.2 47.93,22.2 53.03,27.3 v1(55.72,27.3)
  Bottom Layer w0.3: v1(55.72,27.3) 72.22,43.8 72.22,48 71.03,49.2 69.83,49.2 69.22,48.6 69.22,45.9 R6.1
$1N3033: length 3.6
  Bottom Layer w0.3: U5.1 55.14,51.32
$1N3034: length 3.8
  Bottom Layer w0.3: L2.1 45.56,46.92 U5.5
$1N3036: length 3.8
  Bottom Layer w0.3: L1.1 45.85,51.02 U5.8
$1N3039: length 3.9
  Bottom Layer w0.3: U5.3 54.38,48.78 R8.2
$1N3040: length 4.8
  Bottom Layer w0.3: R9.2 52.35,47.51 U5.4
$1N3042: length 3.1
  Bottom Layer w0.3: R9.1 C8.2
$1N3043: length 3.1
  Bottom Layer w0.3: C7.2 60.14,48.02 R8.1
$1N3051: length 16.4
  Bottom Layer w0.3: R13.3 57.12,61.8 R14.1
$1N3052: length 106.8
  Top Layer w0.3: v1(39.68,84.4) 47.18,84.4 52.32,79.26 58.32,79.26 63.72,73.86 63.72,34.92 v1(64.02,34.62)
  Bottom Layer w0.3: NOREF#2.1 58.62,8.81 58.62,7.02 58.92,6.72 61.32,6.72 64.02,9.41 v1(64.02,34.62) ; v1(39.68,84.4) CN1.3
$1N3053: length 19.2
  Bottom Layer w0.3: CN1.5 43.38,87.1 ; 43.38,87.1 43.38,85.95 R10.1 ; 43.38,87.1 39.18,82.9 34.18,82.9 CN1.2
$1N3056: length 8.8
  Top Layer w0.3: v1(53.33,67.7) 58.53,67.7 LCD2.14 LCD2.13 LCD2.12 LCD2.11
  Bottom Layer w0.3: v1(53.33,67.7) 52.72,68.3 R12.2
$1N3058: length 3.6
  Bottom Layer w0.3: Q3.1 51.34,64.8 R11.2
$1N3060: length 3.5
  Bottom Layer w0.3: R12.1 54.66,68.06 Q3.3
$1N3070: length 3.7
  Bottom Layer w0.3: R2.1 40.41,73.35 41.23,73.35 U3.7
$1N3071: length 3.4
  Bottom Layer w0.3: 41.83,72.68 39.97,72.68 R3.1
$1N3073: length 2.7
  Bottom Layer w0.3: R4.2 50.27,73.95 U3.2

## Copper pours and planes (outline as drawn; the poured copper is in the pictures)
GND on Top Layer: -15.76,105.31 94.04,105.31 94.04,-8.88 -15.76,-8.88
GND on Bottom Layer: -10.96,98.72 88.62,98.72 88.62,-3.8 -10.96,-3.8

## Text on the board
Bottom Silkscreen Layer: C1 | U4 | BAT | Megazoid 2026 | youtube.com/@megazoid | SP + | SP - | - | + | PicoPocket Royale
Top Silkscreen Layer: 18 | 1 | RESET | A | X | Y | B
